# Altium project forwardConverterPCB.PrjPcb (part 14 of 22)
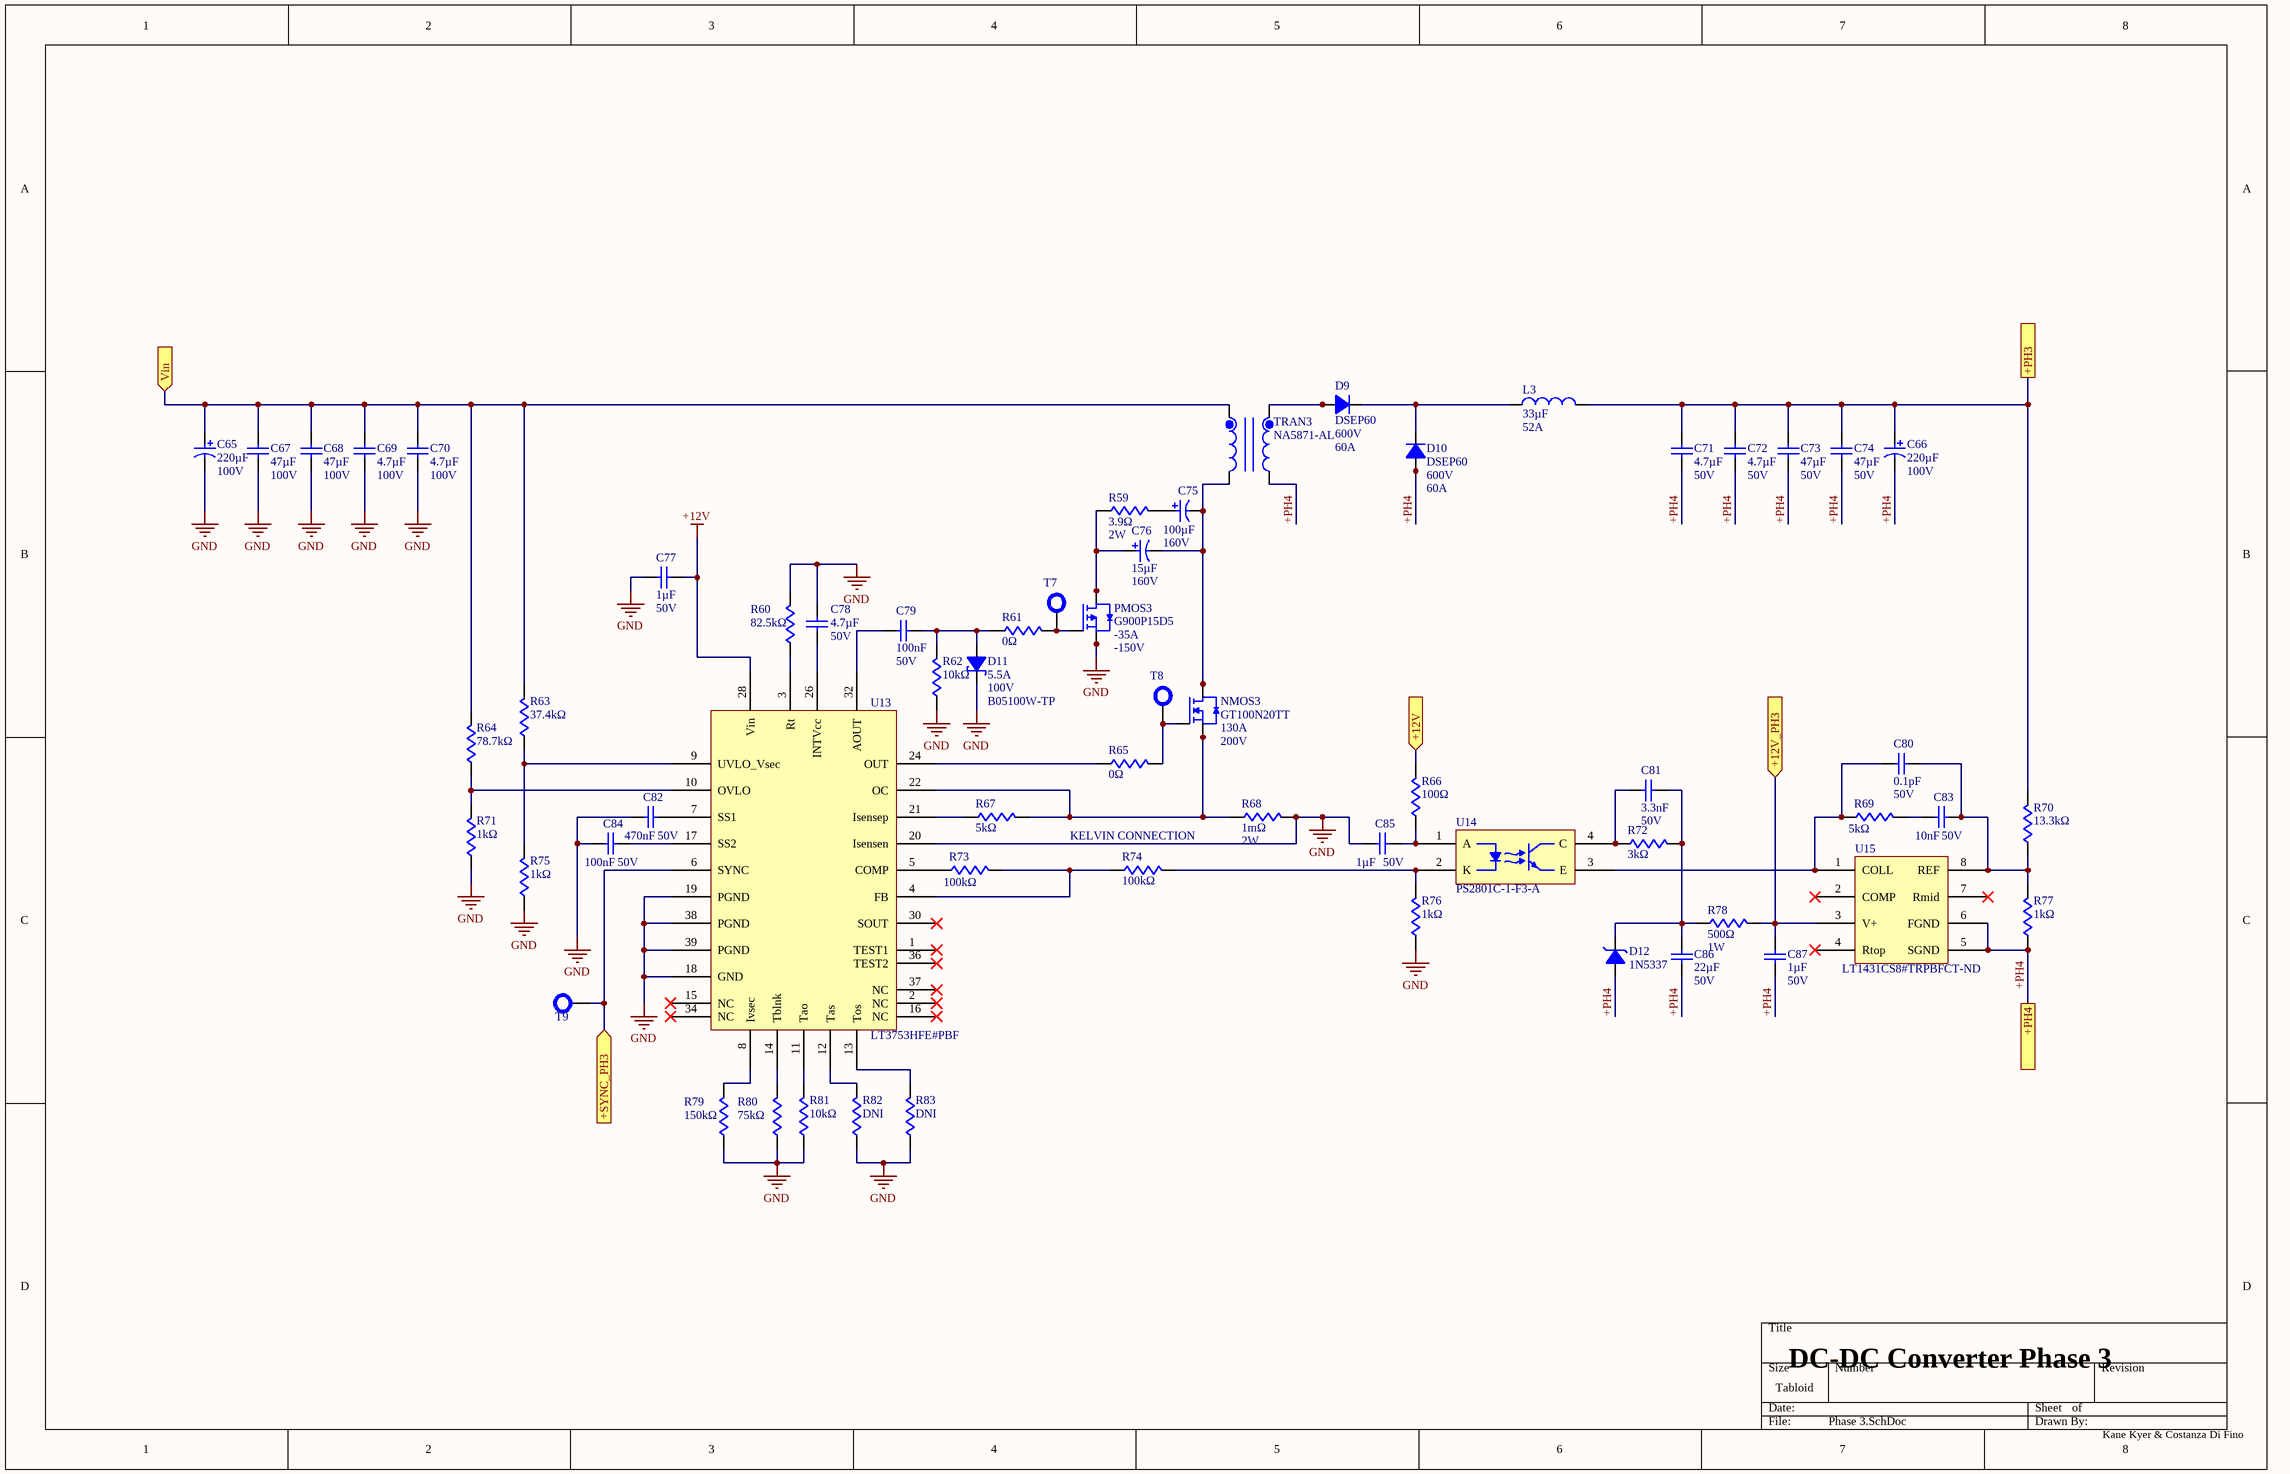
[diagram p19: Phase 3.SchDoc]

## Sheet Phase 3.SchDoc (continued)

### Library data of the parts (continued)
U14 = PS2801C-1-F3-A: Optocoupler DC-IN 1-CH Transistor DC-OUT 4-Pin SSOP T/R; Manufacturer: Renesas; Manufacturer Lifecycle Status: ACTIVE; Collector Emitter Breakdown Voltage: 80V; Collector Emitter Saturation Voltage: 300mV; Current Transfer Ratio: 50%; Dark Current: 100nA; Forward Current: 30mA; Forward Voltage: 1.4V; Input Current: 5mA; Isolation Voltage: 2.5kV; Max Power Dissipation: 120mW; Number of Elements: 1; Reverse Breakdown Voltage: 6V; Target Application: PLC\, Hybrid IC\, Power supply\, OA\, Measuring instrument\, Modem\, Communication devices; Supplier: DigiKey; RoHS: Compliant; Category: Optocouplers; Stock: 8089; Pricing: 1=0.85, 10=0.594, 100=0.436, 500=0.3653, 1000=0.34213 (USD); Case/Package: SSOP; China RoHS: Compliant; Collector Emitter Voltage (VCEO): 80V; Contact Plating: Tin Bismuth; Export Control Classification Number (ECCN) Code: EAR99; Part Family: PS2801C-1; Height: 2.1mm; Harmonized Tariff Schedule (HTS) Code: 8541.49.8000; Lifecycle Status: Production; Max Operating Temperature: 100°C; Min Operating Temperature: -55°C; MSL: 1; Mounting Technology: Surface Mount; Pins: 4; Output Voltage: 80V; Packaging: Cut Tape; REACH SVHC: Yes; ComponentLink1URL: https://datasheet.octopart.com:443/PS2801C-1-F3-A-Renesas-datasheet-179197394.pdf?src-supplier=Integrated+Device+Technology; ComponentLink1Description: https://datasheet.octopart.com:443/PS2801C-1-F3-A-Renesas-datasheet-179197394.pdf?src-supplier=Integrated+Device+Technology; ComponentLink2URL: https://datasheet.octopart.com:443/PS2801C-1-F3-A-Renesas-datasheet-150850810.pdf?src-supplier=Integrated+Device+Technology; ComponentLink2Description: https://datasheet.octopart.com:443/PS2801C-1-F3-A-Renesas-datasheet-150850810.pdf?src-supplier=Integrated+Device+Technology; ComponentLink3URL: https://datasheet.octopart.com:443/PS2801C-1-F3-A-Integrated-Device-Technology-datasheet-149188203.pdf?src-supplier=Integrated+Device+Technology; ComponentLink3Description: https://datasheet.octopart.com:443/PS2801C-1-F3-A-Integrated-Device-Technology-datasheet-149188203.pdf?src-supplier=Integrated+Device+Technology; ComponentLink4URL: https://datasheet.octopart.com:443/PS2801C-1-F3-A-Renesas-datasheet-181196928.pdf?src-supplier=IHS; ComponentLink4Description: https://datasheet.octopart.com:443/PS2801C-1-F3-A-Renesas-datasheet-181196928.pdf?src-supplier=IHS; ComponentLink5URL: https://datasheet.octopart.com:443/PS2801C-1-F3-A-NEC-datasheet-180895691.pdf?src-supplier=IHS; ComponentLink5Description: https://datasheet.octopart.com:443/PS2801C-1-F3-A-NEC-datasheet-180895691.pdf?src-supplier=IHS; ComponentLink6URL: https://datasheet.octopart.com:443/PS2801C-1-F3-A-Renesas-datasheet-138175760.pdf?src-supplier=Renesas; ComponentLink6Description: https://datasheet.octopart.com:443/PS2801C-1-F3-A-Renesas-datasheet-138175760.pdf?src-supplier=Renesas; ComponentLink7URL: https://datasheet.octopart.com:443/PS2801C-1-F3-A-Renesas-datasheet-5346041.pdf?src-supplier=element14+APAC; ComponentLink7Description: https://datasheet.octopart.com:443/PS2801C-1-F3-A-Renesas-datasheet-5346041.pdf?src-supplier=element14+APAC; ComponentLink8URL: https://datasheet.octopart.com:443/PS2801C-1-F3-A-Renesas-datasheet-136880012.pdf?src-supplier=Future+Electronics; ComponentLink8Description: https://datasheet.octopart.com:443/PS2801C-1-F3-A-Renesas-datasheet-136880012.pdf?src-supplier=Future+Electronics; ComponentLink9URL: http://sigma.octopart.com:80/reach_statement/Renesas-company-45.pdf?src-supplier=Compliance+Statements; ComponentLink9Description: http://sigma.octopart.com:80/reach_statement/Renesas-company-45.pdf?src-supplier=Compliance+Statements; ComponentLink10URL: http://sigma.octopart.com:80/conflict_mineral_statement/Renesas-company-44.pdf?src-supplier=Compliance+Statements; ComponentLink10Description: http://sigma.octopart.com:80/conflict_mineral_statement/Renesas-company-44.pdf?src-supplier=Compliance+Statements; Supplier Part Number: 559-1038-1-ND; Manufacturer Part Number: PS2801C-1-F3-A
U15 = LT1431CS8#TRPBF: V-Ref Adjustable 2.5V to 36V 100mA 8-Pin SOIC N T/R; Manufacturer: Analog Devices; Manufacturer Lifecycle Status: PRODUCTION; Cathode Current: 1mA; Reference Type: Shunt; Temperature Coefficient: 30ppm/°C; Tolerance: 0.4%; Supplier: DigiKey; Manufacturer Part Number: LT1431CS8#TRPBF; RoHS: Compliant; Category: Voltage References; Stock: 6692; Pricing: 1=4.76, 10=3.623, 25=3.3384, 100=3.025, 250=2.9682 (USD); Lead Free: Lead Free; Lifecycle Status: Production; Max Operating Temperature: 70°C; Max Output Voltage: 36V; Min Operating Temperature: 0°C; Min Output Voltage: 2.5V; Mounting Technology: Surface Mount; Pins: 8; Output Current: 100mA; Output Type: Adjustable; ComponentLink1URL: https://octopart.com:443/opatz8j6/c1?t=niELlFxzDfi0yCwovPYUCPkFv5h4fu5j3fc6Y_JWgZS-KG3gguwV1nhos1IG-X0q8FOT95_5suT6z4bIqEEHZa5Cr0Tl4wX-4Gea3le2l_P5Btni36aNB0VKN1eACfVw6XjlixpjNPZ2EoCnIZsmdjVtLb4T5dOKJqdmaG9p1s8rLUbRPnop80aw4yYD8dobzP2rtKjoPZxkMFX7s_x1MbrDISVlTufhy0OqU5fodmlGcRlmdB2uK6Q8wi9wAMnylkp3u30aJUXp9y1pTV4VT8brQ8AQsJucKiRghXvlz7QI_mNVRP68og&src-supplier=Analog+Devices; ComponentLink1Description: https://octopart.com:443/opatz8j6/c1?t=niELlFxzDfi0yCwovPYUCPkFv5h4fu5j3fc6Y_JWgZS-KG3gguwV1nhos1IG-X0q8FOT95_5suT6z4bIqEEHZa5Cr0Tl4wX-4Gea3le2l_P5Btni36aNB0VKN1eACfVw6XjlixpjNPZ2EoCnIZsmdjVtLb4T5dOKJqdmaG9p1s8rLUbRPnop80aw4yYD8dobzP2rtKjoPZxkMFX7s_x1MbrDISVlTufhy0OqU5fodmlGcRlmdB2uK6Q8wi9wAMnylkp3u30aJUXp9y1pTV4VT8brQ8AQsJucKiRghXvlz7QI_mNVRP68og&src-supplier=Analog+Devices; ComponentLink2URL: https://datasheet.octopart.com:443/LT1431CS8%23TRPBF-Analog-Devices-datasheet-158590489.pdf?src-supplier=Augswan; ComponentLink2Description: https://datasheet.octopart.com:443/LT1431CS8%23TRPBF-Analog-Devices-datasheet-158590489.pdf?src-supplier=Augswan; ComponentLink3URL: https://sigma.octopart.com:443/57689574/technical_drawing/Linear-Technology-LT1431CS8%23TRPBF.pdf?src-supplier=Linear+Technology; ComponentLink3Description: https://sigma.octopart.com:443/57689574/technical_drawing/Linear-Technology-LT1431CS8%23TRPBF.pdf?src-supplier=Linear+Technology; ComponentLink4URL: https://datasheet.octopart.com:443/LT1431CS8%23TRPBF-Linear-Technology-datasheet-12663249.pdf?src-supplier=Linear+Technology; ComponentLink4Description: https://datasheet.octopart.com:443/LT1431CS8%23TRPBF-Linear-Technology-datasheet-12663249.pdf?src-supplier=Linear+Technology; ComponentLink5URL: https://datasheet.octopart.com:443/LT1431CS8%23TRPBF-Linear-Technology-datasheet-14162000.pdf?src-supplier=iiiC; ComponentLink5Description: https://datasheet.octopart.com:443/LT1431CS8%23TRPBF-Linear-Technology-datasheet-14162000.pdf?src-supplier=iiiC; ComponentLink6URL: https://datasheet.octopart.com:443/LT1431CS8%23TRPBF-Linear-Technology-datasheet-660441.pdf?src-supplier=Component+Distributors+Inc.; ComponentLink6Description: https://datasheet.octopart.com:443/LT1431CS8%23TRPBF-Linear-Technology-datasheet-660441.pdf?src-supplier=Component+Distributors+Inc.; ComponentLink7URL: http://sigma.octopart.com:80/conflict_mineral_statement/Analog-Devices-company-33.pdf?src-supplier=Compliance+Statements; ComponentLink7Description: http://sigma.octopart.com:80/conflict_mineral_statement/Analog-Devices-company-33.pdf?src-supplier=Compliance+Statements; ComponentLink8URL: https://octopart.com:443/opatz8j6/c1?t=x_UgC8z0ZW9HVBYfWtRK1MQXyidqPpcSjAfueHo9YnawvAkFl5SvDyGxYSqo2jvWZKzVJDVTRvwyt6-9bSOmk9hm3rvBRrSJoViBsOBz-zaTqDQ1UuTon1oynDbAG1BJ8LFFGJ-pvHqqe_ahwIPaiUAyxwKDpl_WDXhLfkPwU4s3DC4oM42DqSA56VDCGnGZU0YdFavN5d4mf8bZyX9JjAzy5--p3JbOg0D6jqXi6c2GCo47z_BbYPuyEPlhjEKZPTviFMXkQtwuopNuNXSm1BD9XLOQFCoZDF8jjiZ5eNS4L1NzzTsuyw&src-supplier=Compliance+Statements; ComponentLink8Description: https://octopart.com:443/opatz8j6/c1?t=x_UgC8z0ZW9HVBYfWtRK1MQXyidqPpcSjAfueHo9YnawvAkFl5SvDyGxYSqo2jvWZKzVJDVTRvwyt6-9bSOmk9hm3rvBRrSJoViBsOBz-zaTqDQ1UuTon1oynDbAG1BJ8LFFGJ-pvHqqe_ahwIPaiUAyxwKDpl_WDXhLfkPwU4s3DC4oM42DqSA56VDCGnGZU0YdFavN5d4mf8bZyX9JjAzy5--p3JbOg0D6jqXi6c2GCo47z_BbYPuyEPlhjEKZPTviFMXkQtwuopNuNXSm1BD9XLOQFCoZDF8jjiZ5eNS4L1NzzTsuyw&src-supplier=Compliance+Statements

## Sheet Phase 4.SchDoc
size Tabloid; SheetNumber: 6; SheetTotal: 7
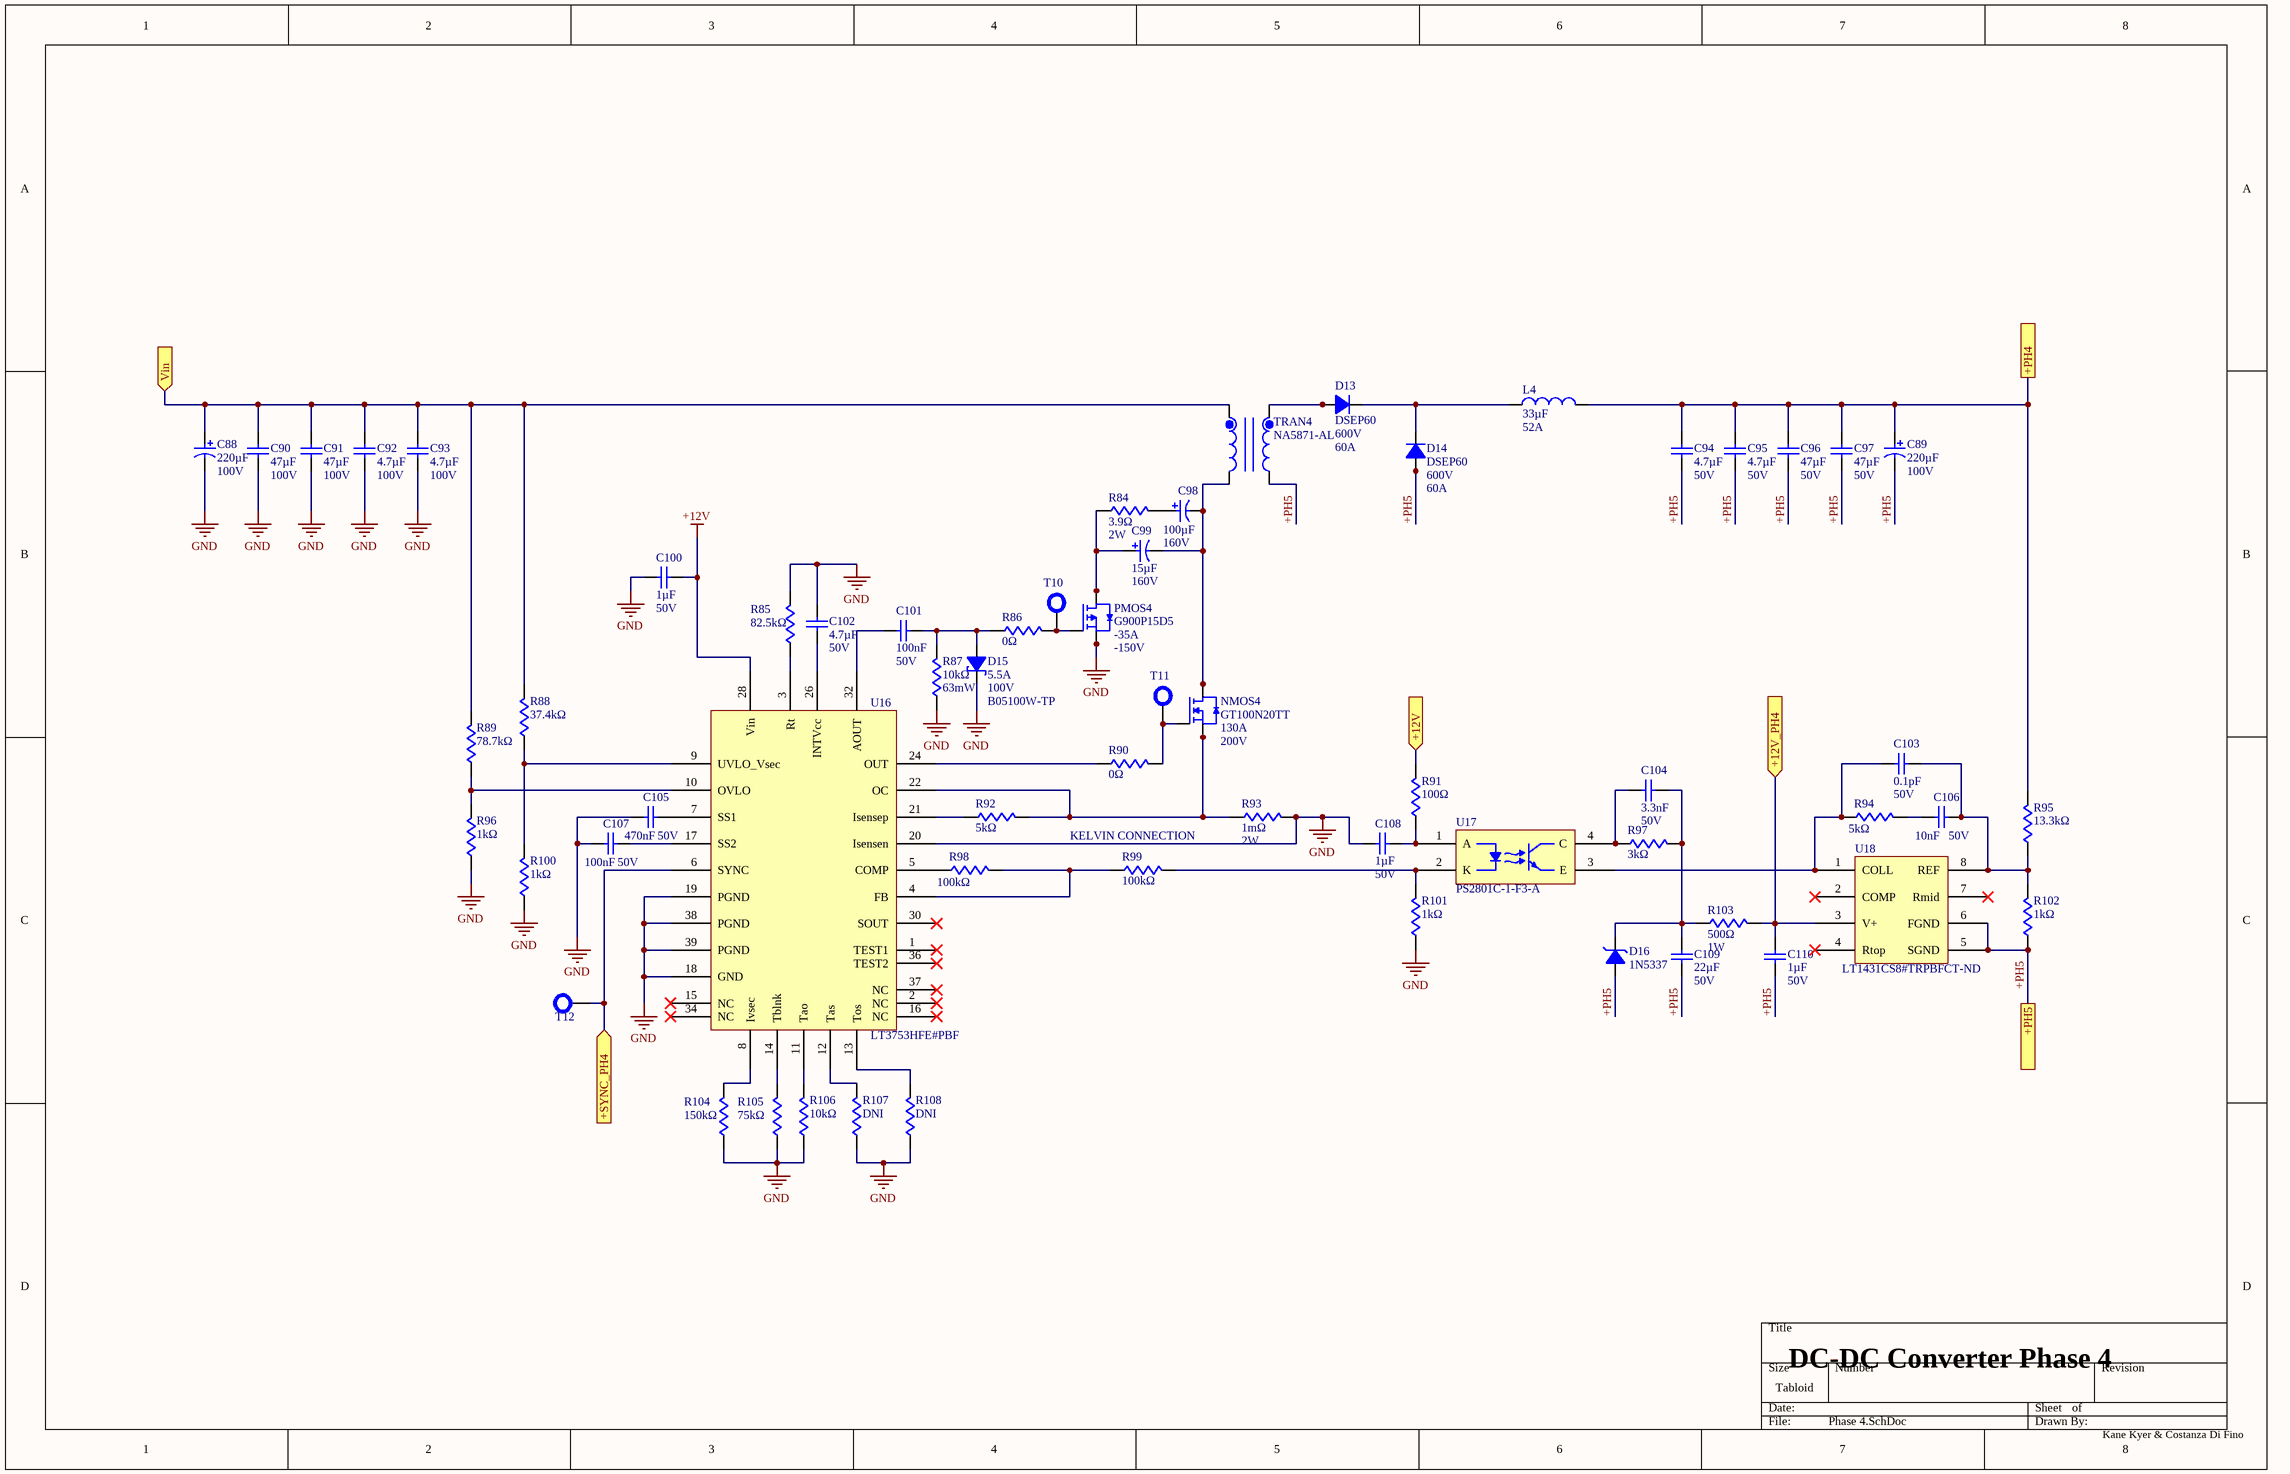
[diagram p5: Phase 4.SchDoc]

### Parts
C88  value 220µF  Voltage Rating: 100V  [C_AEC]  (hidden comment: AFK227M2AR44T-F)
C89  value 220µF  Voltage Rating: 100V  [C_AEC]  (hidden comment: AFK227M2AR44T-F)
C90  value 47µF  Voltage Rating: 100V  [C_CAA573]  (hidden comment: CAA573X7S2A476M640LH)
C91  value 47µF  Voltage Rating: 100V  [C_CAA573]  (hidden comment: CAA573X7S2A476M640LH)
C92  value 4.7µF  Voltage Rating (DC): 100V  [C_1210]  (hidden comment: GMC32X7S475K100NT)
C93  value 4.7µF  Voltage Rating (DC): 100V  [C_1210]  (hidden comment: GMC32X7S475K100NT)
C94  value 4.7µF  Voltage Rating (DC): 50V  [C_1206]  (hidden comment: GMC31X7R475K50NT)
C95  value 4.7µF  Voltage Rating (DC): 50V  [C_1206]  (hidden comment: GMC31X7R475K50NT)
C96  value 47µF  Voltage Rating (DC): 50V  [C_CKG57N]  (hidden comment: CKG57NX7R1H476M500JJ)
C97  value 47µF  Voltage Rating (DC): 50V  [C_CKG57N]  (hidden comment: CKG57NX7R1H476M500JJ)
C98  value 100µF  Voltage Rating (DC): 160V  [UUJ2C101MNJ1MS]  (hidden comment: UUJ2C101MNJ1MS)
C99  value 15µF  Voltage: 160V  [ULT2C150MNL1GS]  (hidden comment: ULT2C150MNL1GS)
C100  value 1µF  Voltage: 50V  [C_0805]  (hidden comment: CL21B105KBFNNNE)
C101  value 100nF  Voltage Rating: 50V  [C_0603]  (hidden comment: C0603C104K5RACTU)
C102  value 4.7µF  Voltage Rating (DC): 50V  [C_1206]  (hidden comment: GMC31X7R475K50NT)
C103  value 0.1pF  Voltage Rating: 50V  [C_0402]  (hidden comment: GJM1555C1HR10WB01D)
C104  value 3.3nF  Voltage Rating: 50V  [C_0603]  (hidden comment: GCM1885C1H332FA16D)
C105  value 470nF  Voltage Rating: 50V  [C_0402]  (hidden comment: GRM155R61H474KE11D)
C106  value 10nF  Voltage Rating: 50V  [C_0603]  (hidden comment: C0603C103K5RACTU)
C107  value 100nF  Voltage Rating: 50V  [C_0603]  (hidden comment: C0603C104K5RACTU)
C108  value 1µF  Voltage: 50V  [C_0805]  (hidden comment: CL21B105KBFNNNE)
C109  value 22µF  Voltage Rating (DC): 50V  [C_2220]  (hidden comment: GMC55X7R226M50NT)
C110  value 1µF  Voltage: 50V  [C_0805]  (hidden comment: CL21B105KBFNNNE)
D13  DSEP60  Vr: 600V  Io: 60A  [D_DSEP60]
D14  DSEP60  Vr: 600V  Io: 60A  [D_DSEP60]
D15  Max Forward Surge Current (Ifsm): 5.5A  Min Breakdown Voltage: 100V  [D_B05100W]  (hidden comment: B05100W-TP)
D16  Supplier Part Number: 1N5337  [D_1N5337]  (hidden comment: 1N5337BRLG)
L4  value 33µF  Irms: 52A  [CPEX4141L-330MC]  (hidden comment: CPEX4141L-330MC)
NMOS4  Id: 130A  Vds: 200V  [GT100N20TT]  (hidden comment: GT100N20TT)
PMOS4  Id: -35A  Vds: -150V  [G900P15]  (hidden comment: G900P15D5)
R84  value 3.9Ω  Power Rating: 2W  [R_SM2W]  (hidden comment: SMW23R9JT)
R85  value 82.5kΩ  [R_0805]  (hidden comment: RMCF0805FT82K5)
R86  value 0Ω  [R_0805]  (hidden comment: CRCW08050000Z0EA)
R87  value 10kΩ  Power Rating: 63mW  [R_0402]  (hidden comment: RM04F1002CT)
R88  value 37.4kΩ  [R_0603]  (hidden comment: RC0603FR-0737K4L)
R89  value 78.7kΩ  [R_0603]  (hidden comment: RC0603FR-0778K7L)
R90  value 0Ω  [R_0805]  (hidden comment: CRCW08050000Z0EA)
R91  value 100Ω  [R_0603]  (hidden comment: RC0603FR-07100RL)
R92  value 5kΩ  [R_0402]  (hidden comment: PNM0402E5001BST1)
R93  value 1mΩ  Power Rating: 2W  [R_2512]  (hidden comment: CRE2512-FZ-R001E-2)
R94  value 5kΩ  [R_0402]  (hidden comment: PNM0402E5001BST1)
R95  value 13.3kΩ  [R_0603]  (hidden comment: RMCF0603FT13K3)
R96  value 1kΩ  [R_0402]  (hidden comment: RM04F1001CT)
R97  value 3kΩ  [C_0402]  (hidden comment: AC0402FR-073KL)
R98  value 100kΩ  [R_0402]  (hidden comment: RM04F1003CT)
R99  value 100kΩ  [R_0402]  (hidden comment: RM04F1003CT)
R100  value 1kΩ  [R_0402]  (hidden comment: RM04F1001CT)
R101  value 1kΩ  [R_0402]  (hidden comment: RM04F1001CT)
R102  value 1kΩ  [R_0402]  (hidden comment: RM04F1001CT)
R103  value 500Ω  Power Rating: 1W  [R_WSC2515]  (hidden comment: WSC2515500R0FEB)
R104  value 150kΩ  [R_0603]  (hidden comment: RC0603FR-07150KL)
R105  value 75kΩ  [R_0603]  (hidden comment: AC0603FR-0775KL)
R106  value 10kΩ  [R_0402]  (hidden comment: RM04F1002CT)
R107  value DNI  [R_0805]  (hidden comment: CRCW08050000Z0EA)
R108  value DNI  [R_0805]  (hidden comment: CRCW08050000Z0EA)
T10  TEST  [TEST_POINT]  (value not drawn)
T11  TEST  [TEST_POINT]  (value not drawn)
T12  TEST  [TEST_POINT]  (value not drawn)
TRAN4  NA5871-AL  [NA5871-AL]
U16  LT3753HFE#PBF  [LT3753]
U17  PS2801C-1-F3-A  [PS2801C]
U18  Supplier Part Number: LT1431CS8#TRPBFCT-ND  [LT1431]  (hidden comment: LT1431CS8#TRPBF)

### Ports
+12V (in, see SHEET_MAP[4C], Externals[2A], Phase 1[4C], Phase 2[4C], Phase 3[4C], Phase 5[4B]), +12V_PH4 (in, see SHEET_MAP[4C], Externals[6B]), +PH4 (see SHEET_MAP[4C], Externals[6B], Phase 3[6C]), +PH5 (see SHEET_MAP[4C], Externals[6C], Phase 5[6B]), +SYNC_PH4 (in, see SHEET_MAP[4C], Externals[3C]), Vin (in, see SHEET_MAP[4C], Externals[1A], Phase 1[1B], Phase 2[1B], Phase 3[1B], Phase 5[1B])

### Nets
+12V: C100.2 R91.2 U16.28(Vin) ; port +12V
GND: C88.2 C90.1 C91.1 C92.1 C93.1 C100.1 C102.1 C105.1 C107.1 C108.1 D15.1 PMOS4.1(S) PMOS4.2(S) PMOS4.3(S) R85.2 R87.1 R93.2 R96.1 R100.1 R101.1 R104.1 R105.1 R106.1 R107.1 R108.1 U16.18(GND) U16.19(PGND) U16.20(Isensen) U16.38(PGND) U16.39(PGND)
Vin: C88.1 C90.2 C91.2 C92.2 C93.2 R88.2 R89.2 TRAN4.1 ; port Vin
+PH4: C89.1 C94.2 C95.2 C96.2 C97.2 L4.2 R95.2 ; port +PH4
+PH5: C89.2 C94.1 C95.1 C96.1 C97.1 C109.1 C110.1 D14.1(A) D14.3(A) D16.2 R102.1 TRAN4.11 U18.5(SGND) U18.6(FGND) ; port +PH5
NetC33_2: C110.2 R103.2 U18.3(V+) ; port +12V_PH4
NetC98_1: C98.1 R84.2
NetC98_2: C98.2 C99.2 NMOS4.9(D) NMOS4.10(D) NMOS4.11(D) NMOS4.12(D) NMOS4.13(D) NMOS4.14(D) NMOS4.15(D) NMOS4.16(D) TRAN4.4
NetC99_1: C99.1 PMOS4.5(D) PMOS4.6(D) PMOS4.7(D) PMOS4.8(D) R84.1
NetC101_1: C101.1 U16.32(AOUT)
NetC101_2: C101.2 D15.2 R86.1 R87.2
NetC102_2: C102.2 U16.26(INTVcc)
NetC103_1: C103.1 R94.1 U17.3(E) U18.1(COLL)
NetC103_2: C103.2 C106.2 R95.1 R102.2 U18.8(REF)
NetC104_1: C104.1 R97.1 U17.4(C)
NetC104_2: C104.2 C109.2 D16.1 R97.2 R103.1
NetC105_2: C105.2 U16.7(SS1)
NetC106_1: C106.1 R94.2
NetC107_2: C107.2 U16.17(SS2)
NetC108_2: C108.2 R91.1 U17.1(A)
NetD13_1: D13.1(A) D13.3(A) TRAN4.6
NetD13_4: D13.4(C) D14.4(C) L4.1
NetNMOS4_1: NMOS4.1(S) NMOS4.2(S) NMOS4.3(S) NMOS4.4(S) NMOS4.5(S) NMOS4.6(S) NMOS4.7(S) R92.2 R93.1 U16.22(OC)
NetNMOS4_8: NMOS4.8(G) R90.2 T11.1
NetPMOS4_4: PMOS4.4(G) R86.2 T10.1
NetR85_1: R85.1 U16.3(Rt)
NetR88_1: R88.1 R100.2 U16.9(UVLO_Vsec)
NetR89_1: R89.1 R96.2 U16.10(OVLO)
NetR90_1: R90.1 U16.24(OUT)
NetR92_1: R92.1 U16.21(Isensep)
NetR98_1: R98.1 U16.5(COMP)
NetR98_2: R98.2 R99.1 U16.4(FB)
NetR99_2: R99.2 R101.2 U17.2(K)
NetR104_2: R104.2 U16.8(Ivsec)
NetR105_2: R105.2 U16.14(Tblnk)
NetR106_2: R106.2 U16.11(Tao)
NetR107_2: R107.2 U16.12(Tas)
NetR108_2: R108.2 U16.13(Tos)
NetT12_1: T12.1 U16.6(SYNC) ; port +SYNC_PH4

Not connected (* = marked no-connect by the designer): U16 1(TEST1)* 2(NC)* 15(NC)* 16(NC)* 30(SOUT)* 34(NC)* 36(TEST2)* 37(NC)*; U18 2(COMP)* 4(Rtop)* 7(Rmid)*

### Notes on the sheet
- (near R99) KELVIN CONNECTION
- DC-DC Converter Phase 4
- Kane Kyer & Costanza Di Fino